# EAGLE design CTR cubesat (EAGLE 9.0.0)
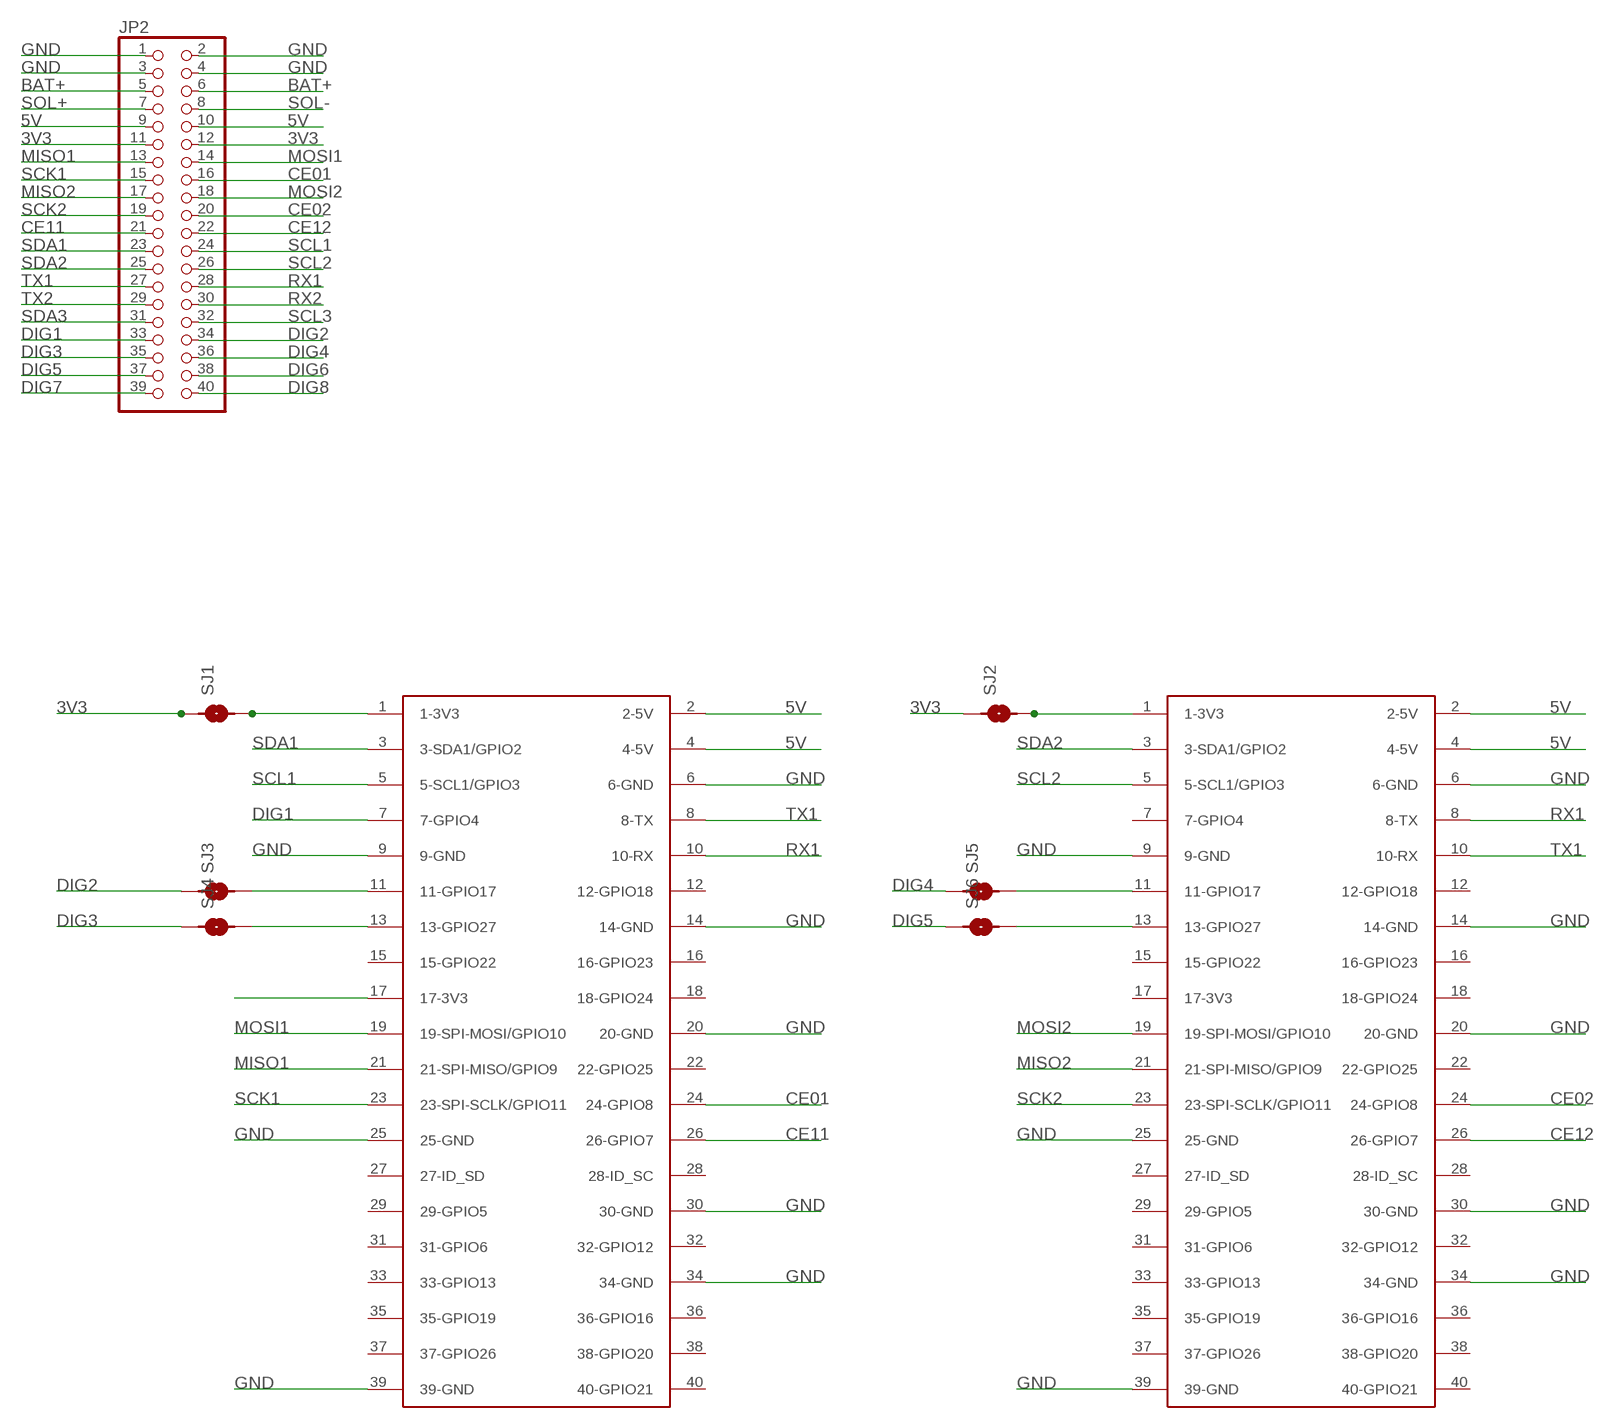
[diagram p0: schematic, sheet 1]

## Parts
JP2  PINHD-2X20  [2X20]
SJ1  SMD-JUMPER-2  [SMD-JUMPER-2]
SJ2  SMD-JUMPER-2  [SMD-JUMPER-2]
SJ3  SMD-JUMPER-2  [SMD-JUMPER-2]
SJ4  SMD-JUMPER-2  [SMD-JUMPER-2]
SJ5  SMD-JUMPER-2  [SMD-JUMPER-2]
SJ6  SMD-JUMPER-2  [SMD-JUMPER-2]
U$1  RASPBERRY-PI+PIZERO  [RASPBERRY-PI-ZERO]
U$2  RASPBERRY-PI+PIZERO  [RASPBERRY-PI-ZERO]

## Nets
3V3: JP2.11 JP2.12 SJ1.1 SJ2.1
5V: JP2.9 JP2.10 U$1.2(2-5V) U$1.4(4-5V) U$2.2(2-5V) U$2.4(4-5V)
BAT+: JP2.5 JP2.6
CE01: JP2.16 U$2.24(24-GPIO8)
CE02: JP2.20 U$1.24(24-GPIO8)
CE11: JP2.21 U$2.26(26-GPIO7)
CE12: JP2.22 U$1.26(26-GPIO7)
DIG1: JP2.33 U$2.7(7-GPIO4)
DIG2: JP2.34 SJ3.1
DIG3: JP2.35 SJ4.1
DIG4: JP2.36 SJ5.1
DIG5: JP2.37 SJ6.1
DIG6: JP2.38
DIG7: JP2.39
DIG8: JP2.40
GND: JP2.1 JP2.2 JP2.3 JP2.4 U$1.6(6-GND) U$1.9(9-GND) U$1.14(14-GND) U$1.20(20-GND) U$1.25(25-GND) U$1.30(30-GND) U$1.34(34-GND) U$1.39(39-GND) U$2.6(6-GND) U$2.9(9-GND) U$2.14(14-GND) U$2.20(20-GND) U$2.25(25-GND) U$2.30(30-GND) U$2.34(34-GND) U$2.39(39-GND)
MISO1: JP2.13 U$2.21(21-SPI-MISO/GPIO9)
MISO2: JP2.17 U$1.21(21-SPI-MISO/GPIO9)
MOSI1: JP2.14 U$2.19(19-SPI-MOSI/GPIO10)
MOSI2: JP2.18 U$1.19(19-SPI-MOSI/GPIO10)
N$1: SJ1.2 U$2.1(1-3V3)
N$2: SJ2.2 U$1.1(1-3V3)
N$3: SJ3.2 U$2.11(11-GPIO17)
N$4: SJ4.2 U$2.13(13-GPIO27)
N$5: U$2.17(17-3V3)
N$6: SJ5.2 U$1.11(11-GPIO17)
N$7: SJ6.2 U$1.13(13-GPIO27)
RX1: JP2.28 U$1.8(8-TX) U$2.10(10-RX)
RX2: JP2.30
SCK1: JP2.15 U$2.23(23-SPI-SCLK/GPIO11)
SCK2: JP2.19 U$1.23(23-SPI-SCLK/GPIO11)
SCL1: JP2.24 U$2.5(5-SCL1/GPIO3)
SCL2: JP2.26 U$1.5(5-SCL1/GPIO3)
SCL3: JP2.32
SDA1: JP2.23 U$2.3(3-SDA1/GPIO2)
SDA2: JP2.25 U$1.3(3-SDA1/GPIO2)
SDA3: JP2.31
SOL+: JP2.7
SOL-: JP2.8
TX1: JP2.27 U$1.10(10-RX) U$2.8(8-TX)
TX2: JP2.29
Unconnected: U$1.7(7-GPIO4) U$1.12(12-GPIO18) U$1.15(15-GPIO22) U$1.16(16-GPIO23) U$1.17(17-3V3) U$1.18(18-GPIO24) U$1.22(22-GPIO25) U$1.27(27-ID_SD) U$1.28(28-ID_SC) U$1.29(29-GPIO5) U$1.31(31-GPIO6) U$1.32(32-GPIO12) U$1.33(33-GPIO13) U$1.35(35-GPIO19) U$1.36(36-GPIO16) U$1.37(37-GPIO26) U$1.38(38-GPIO20) U$1.40(40-GPIO21) U$2.12(12-GPIO18) U$2.15(15-GPIO22) U$2.16(16-GPIO23) U$2.18(18-GPIO24) U$2.22(22-GPIO25) U$2.27(27-ID_SD) U$2.28(28-ID_SC) U$2.29(29-GPIO5) U$2.31(31-GPIO6) U$2.32(32-GPIO12) U$2.33(33-GPIO13) U$2.35(35-GPIO19) U$2.36(36-GPIO16) U$2.37(37-GPIO26) U$2.38(38-GPIO20) U$2.40(40-GPIO21)

## Library data of the parts
JP2 = pinhead:PINHD-2X20: PIN HEADER
SJ1-SJ6 = FaBo-etc:SMD-JUMPER-2
U$1 U$2 = Ava:RASPBERRY-PI+: Samtec SSW-120-01-T-D

## Board
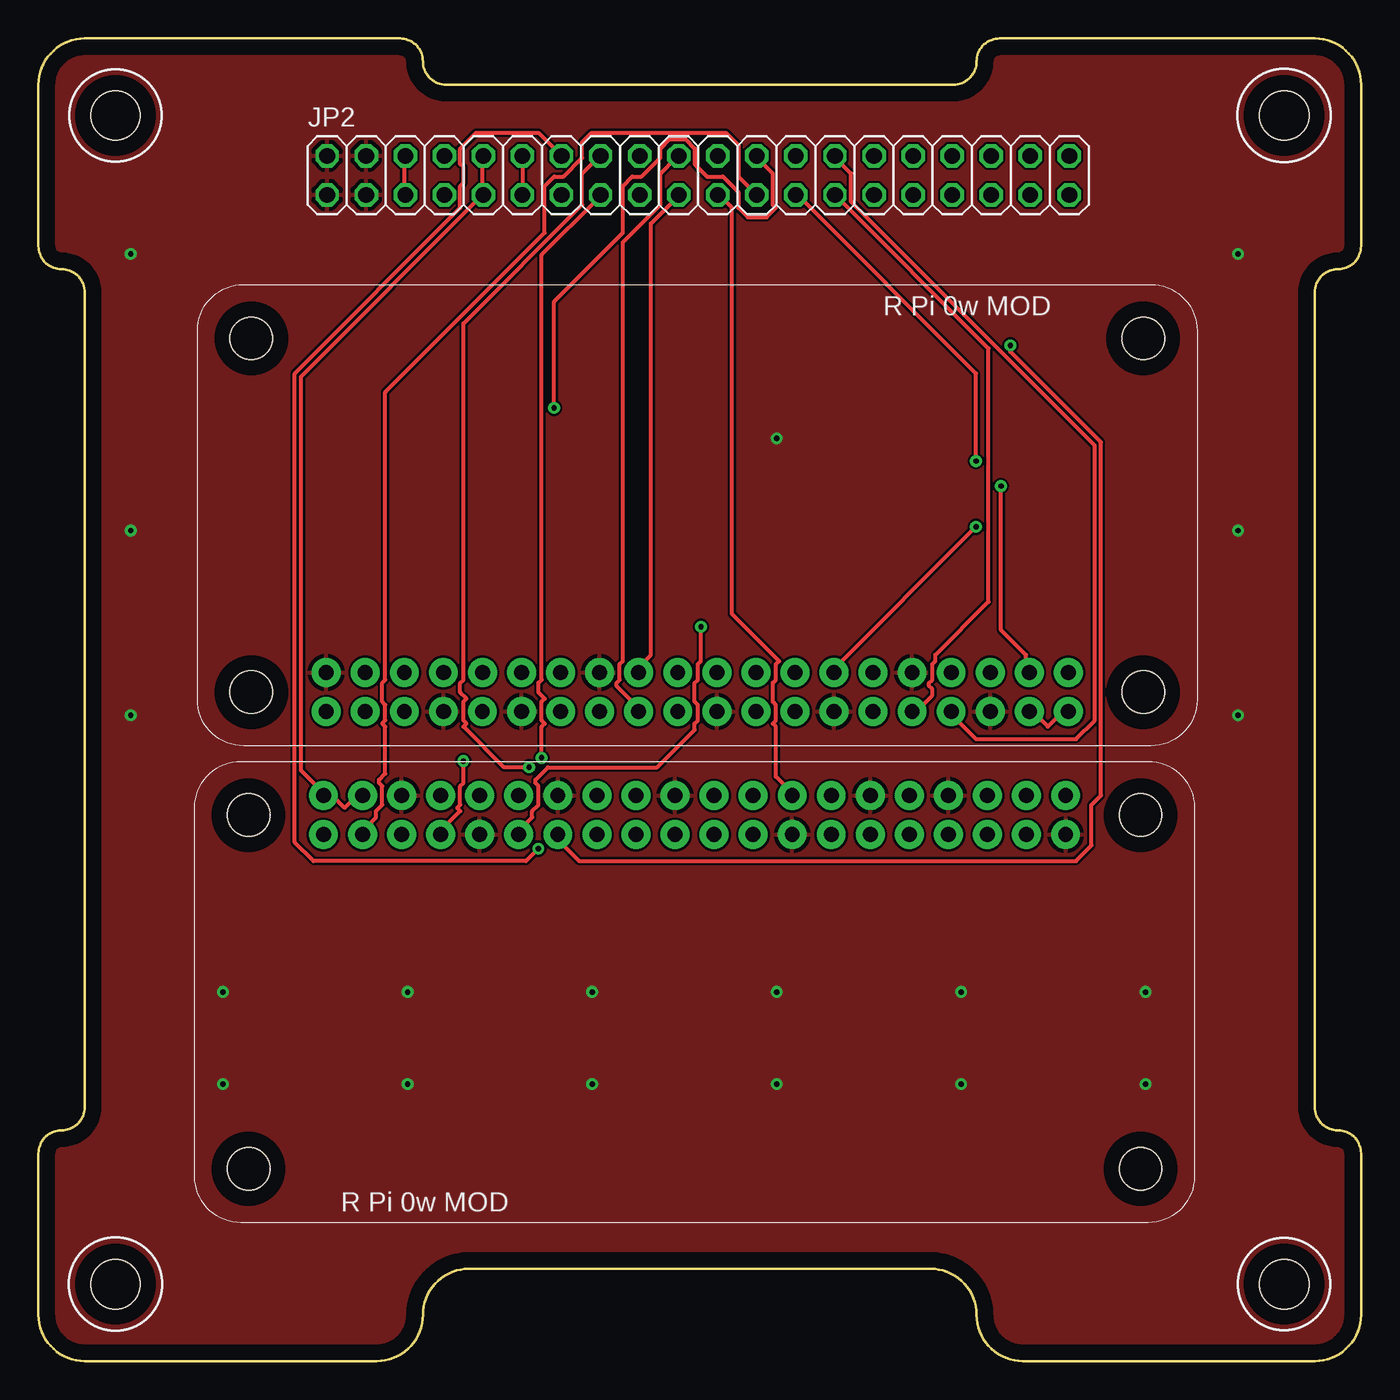
[diagram p1: board, top side]
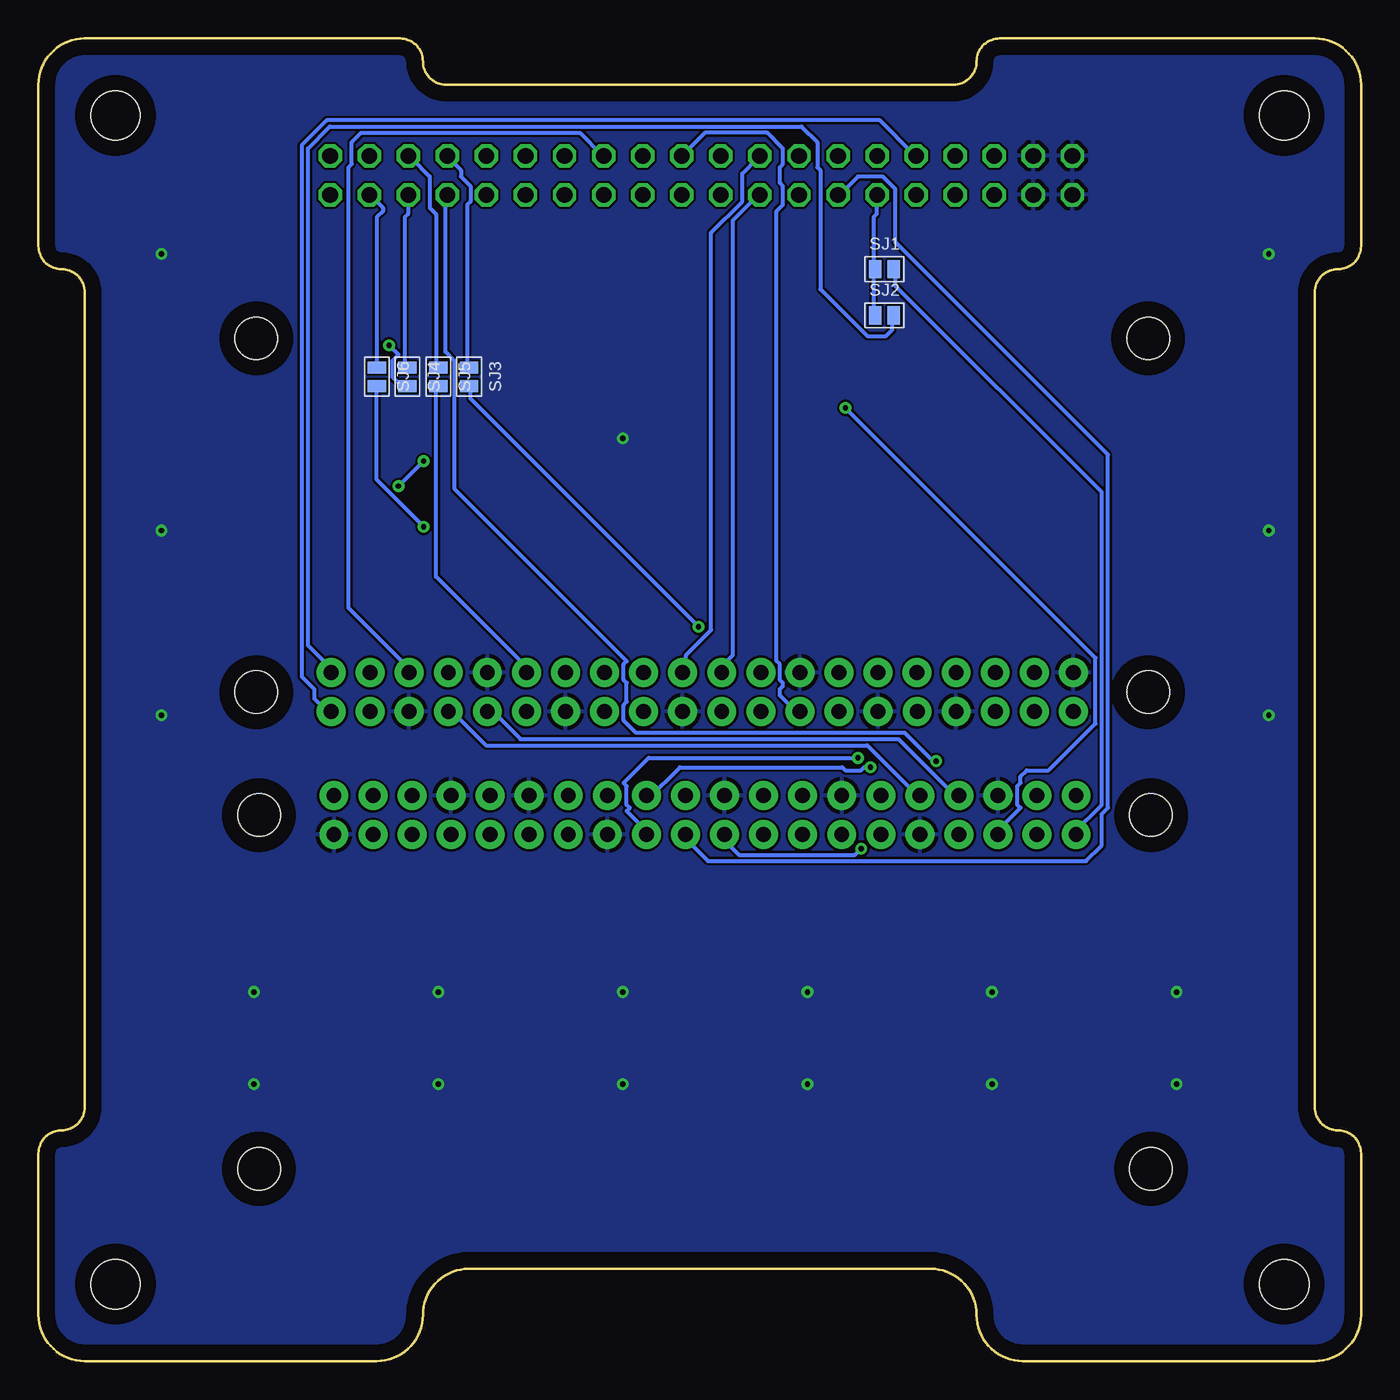
[diagram p2: board, bottom side, seen from below]

Size 86 x 86 mm. Coordinates in mm from the lower left corner, seen from the top.
Outline: 0,83 0,72.5 arc90 1.5,71 arc-90 3,69.5 3,16.5 arc-90 1.5,15 arc90 0,13.5 0,3 arc90 3,0 22,0 arc90 25,3 arc-90 28,6 58,6 arc-90 61,3 arc90 64,0 83,0 arc90 86,3 86,13.5 arc90 84.5,15 arc-90 83,16.5 83,69.5 arc-90 84.5,71 arc90 86,72.5 86,83 arc90 83,86 62.5,86 arc90 61,84.5 arc-90 59.5,83 26.5,83 arc-90 25,84.5 arc90 23.5,86 3,86 arc90 0,83
Copper layers (1*16): Top 0.035mm / dielectric 1.5mm / Bottom 0.035mm
Design rules "default *": minimum track width 10mil, minimum drill 0.35mm, track to track 6mil, track to pad 6mil, pad to pad 6mil, via to via 6mil, smd to smd 6mil, copper to edge 40mil, drill to drill 6mil, minimum pad ring 10mil, minimum via ring 8mil, stop-mask expansion 4mil, vias tented up to drill 100mil, thermal gap 10mil
Holes 3.2 mm at 5,5 81,5 81,81 5,81

### Footprints (pad centres in the part's own frame; a part is rotated, then mirrored left to right if it is on the bottom)
2X20 = drill 1.016 octagon: 1 -24.13,-1.27; 2 -24.13,1.27; 3 -21.59,-1.27; 4 -21.59,1.27; 5 -19.05,-1.27; 6 -19.05,1.27; 7 -16.51,-1.27; 8 -16.51,1.27; 9 -13.97,-1.27; 10 -13.97,1.27; 11 -11.43,-1.27; 12 -11.43,1.27; 13 -8.89,-1.27; 14 -8.89,1.27; 15 -6.35,-1.27; 16 -6.35,1.27; 17 -3.81,-1.27; 18 -3.81,1.27; 19 -1.27,-1.27; 20 -1.27,1.27; 21 1.27,-1.27; 22 1.27,1.27; 23 3.81,-1.27; 24 3.81,1.27; 25 6.35,-1.27; 26 6.35,1.27; 27 8.89,-1.27; 28 8.89,1.27; 29 11.43,-1.27; 30 11.43,1.27; 31 13.97,-1.27; 32 13.97,1.27; 33 16.51,-1.27; 34 16.51,1.27; 35 19.05,-1.27; 36 19.05,1.27; 37 21.59,-1.27; 38 21.59,1.27; 39 24.13,-1.27; 40 24.13,1.27
SMD-JUMPER-2 = smd 0.8 x 1.2: 1 -0.6,0; 2 0.6,0
RASPBERRY-PI-ZERO = drill 0.97 pad 1.88: 1 -23.97,23.23; 2 -23.97,25.77; 3 -21.43,23.23; 4 -21.43,25.77; 5 -18.89,23.23; 6 -18.89,25.77; 7 -16.35,23.23; 8 -16.35,25.77; 9 -13.81,23.23; 10 -13.81,25.77; 11 -11.27,23.23; 12 -11.27,25.77; 13 -8.73,23.23; 14 -8.73,25.77; 15 -6.19,23.23; 16 -6.19,25.77; 17 -3.65,23.23; 18 -3.65,25.77; 19 -1.11,23.23; 20 -1.11,25.77; 21 1.43,23.23; 22 1.43,25.77; 23 3.97,23.23; 24 3.97,25.77; 25 6.51,23.23; 26 6.51,25.77; 27 9.05,23.23; 28 9.05,25.77; 29 11.59,23.23; 30 11.59,25.77; 31 14.13,23.23; 32 14.14,25.77; 33 16.67,23.23; 34 16.67,25.77; 35 19.21,23.23; 36 19.21,25.77; 37 21.75,23.23; 38 21.75,25.77; 39 24.29,23.23; 40 24.29,25.77 | hole 2.75: -28.84,24.5; 29.16,24.5; -28.84,1.5; 29.16,1.5

### Placement (x,y rotation side)
JP2  42.9,77.1 0 top
SJ1  31,71 0 bottom
SJ2  31,68 0 bottom
SJ3  58,64 270 bottom
SJ4  62,64 270 bottom
SJ5  60,64 270 bottom
SJ6  64,64 270 bottom
U$1  43,68 180 top
U$2  42.5,11 0 top

### Tracks (layer width: path | path; a pad name or v marks a point on that pad's centre or on a via)
3V3
  Top 0.254: JP2.12 31.5,78.23 31.5,76 JP2.11
  Bottom 0.254: SJ2.1 31.7,68.07 31.7,70.92 SJ1.1 31.7,71.12 31.7,74.37 31.5,74.57 31.5,75.79 JP2.11
5V
  Top 0.254: U$1.4 64.62,42.06 64.82,42.06 65.63,41.25 66.45,42.06 66.85,42.06 U$1.2 | JP2.10 28.85,78.23 28.85,76 JP2.9 28.85,75.79 17.07,64.01 17.07,38.41 18.69,36.78 U$2.2 18.69,36.58 19.3,36.58 19.91,35.97 20.52,36.58 20.93,36.58 U$2.4
  Bottom 0.254: U$1.2 67.06,42.27 67.46,42.67 67.67,42.67 68.07,43.08 68.07,43.69 68.89,44.5 68.89,79.05 67.26,80.67 31.29,80.67 29.06,78.44 JP2.10
BAT+
  Top 0.254: JP2.5 23.77,76 23.77,78.23 JP2.6
CE01  (via drill 0.35)
  Top 0.254: v31.9,38.61 30.28,38.61 27.64,41.25 27.84,41.45 27.64,41.66 27.64,42.88 27.84,43.08 27.43,43.48 27.43,44.09 27.64,44.3 27.64,67.46 35.36,75.18 35.36,77.22 36.37,78.23 JP2.16
  Bottom 0.254: v31.9,38.61 32.31,38.61 32.51,38.41 33.53,38.41 33.73,38.61 44.3,38.61 46.33,36.58 U$2.24
CE02
  Top 0.254: JP2.20 41.45,78.23 40.44,77.22 40.44,75.18 38,72.75 38,45.52 37.8,45.31 37.8,44.3 37.59,44.09 37.59,43.89 39.22,42.27 U$1.24
CE11
  Top 0.254: JP2.21 44.3,75.79 45.11,74.98 45.11,48.56 48.16,45.52 47.95,45.31 47.95,44.3 47.75,44.09 47.75,42.88 47.95,42.67 47.95,41.66 47.75,41.45 47.95,41.25 47.95,38 49.17,36.78 U$2.26
CE12
  Bottom 0.254: JP2.22 44.09,78.44 42.67,79.86 38.61,79.86 37.59,78.84 37.59,77.83 37.8,77.62 37.8,76.61 37.59,76.4 37.59,75.18 38,74.78 38,45.52 37.8,45.31 37.8,44.3 37.59,44.09 37.59,43.89 37.8,43.69 37.8,43.28 36.58,42.06 U$1.26
DIG1  (via drill 0.35)
  Top 0.254: v27.64,39.01 27.64,37.59 27.43,37.39 27.43,36.17 27.23,35.97 27.43,35.76 26.01,34.34 U$2.7
  Bottom 0.254: v27.64,39.01 27.84,39.01 29.67,40.84 47.14,40.84 47.95,41.66 47.95,42.67 47.75,42.88 47.75,44.09 47.95,44.3 47.95,45.31 47.75,45.52 58.93,56.69 58.93,65.02 59.54,65.63 59.54,75.79 JP2.33
DIG2
  Bottom 0.254: SJ3.1 58.12,64.62 58.12,75.18 57.91,75.39 57.91,76.4 58.52,77.01 58.52,77.42 59.33,78.23 JP2.34
DIG3
  Bottom 0.254: SJ4.1 62.18,64.62 62.18,74.37 61.98,74.57 61.98,75.79 JP2.35
DIG4
  Bottom 0.254: SJ5.1 60.15,64.62 60.15,74.57 60.55,74.98 60.55,77.01 61.77,78.23 JP2.36
DIG5
  Bottom 0.254: SJ6.1 64.01,64.62 64.01,74.37 63.6,74.78 63.6,74.98 64.41,75.79 JP2.37
GND  (via drill 0.35)
  other vias: 12,24 24,24 24,18 36,24 36,18 48,24 48,18 60,24 60,18 72,24 72,18 12,18 6,72 78,72 6,54 78,54 6,42 78,42 48,60
  pour Top: 64,0 83,0 arc90 86,3 86,13.5 arc90 84.5,15 arc-90 83,16.5 83,69.5 arc-90 84.5,71 arc90 86,72.5 86,83 arc90 83,86 62.5,86 arc90 61,84.5 arc-90 59.5,83 26.5,83 arc-90 25,84.5 arc90 23.5,86 3,86 arc90 0,83 0,72.5 arc90 1.5,71 arc-90 3,69.5 3,16.5 arc-90 1.5,15 arc90 0,13.5 0,3 arc90 3,0 22,0 arc90 25,3 arc-90 28,6 58,6 arc-90 61,3 arc90
  pour Bottom: 64,0 83,0 arc90 86,3 86,13.5 arc90 84.5,15 arc-90 83,16.5 83,69.5 arc-90 84.5,71 arc90 86,72.5 86,83 arc90 83,86 62.5,86 arc90 61,84.5 arc-90 59.5,83 26.5,83 arc-90 25,84.5 arc90 23.5,86 3,86 arc90 0,83 0,72.5 arc90 1.5,71 arc-90 3,69.5 3,16.5 arc-90 1.5,15 arc90 0,13.5 0,3 arc90 3,0 22,0 arc90 25,3 arc-90 28,6 58,6 arc-90 61,3 arc90
MISO1
  Bottom 0.254: JP2.13 33.93,76 33.73,76 32.72,77.01 31.09,77.01 30.28,76.2 30.28,72.75 16.46,58.93 16.46,35.97 16.87,35.56 16.87,33.53 17.88,32.51 42.47,32.51 44.09,34.14 U$2.21
MISO2
  Bottom 0.254: JP2.17 39.22,75.79 40.84,74.17 40.84,45.92 41.45,45.31 41.45,44.91 U$1.21
MOSI1  (via drill 0.35)
  Top 0.254: v32.51,33.33 31.7,32.51 17.88,32.51 16.66,33.73 16.66,64.21 27.43,74.98 27.43,76.4 27.64,76.61 27.64,77.62 27.43,77.83 27.43,78.84 28.45,79.86 32.51,79.86 33.93,78.44 JP2.14
  Bottom 0.254: v32.51,33.33 32.92,32.92 40.44,32.92 41.25,33.73 41.25,34.14 U$2.19
MOSI2
  Bottom 0.254: JP2.18 39.22,78.23 40.23,77.22 40.23,75.39 42.27,73.36 42.27,47.55 43.89,45.92 43.89,45.11 44.09,44.91 U$1.19
N$1
  Bottom 0.254: SJ1.2 30.28,70.92 30.28,69.9 16.87,56.49 16.87,36.17 18.69,34.34 U$2.1
N$2
  Bottom 0.254: SJ2.2 30.48,67.87 30.48,67.06 30.89,66.65 32.11,66.65 35.15,69.7 35.15,77.42 35.36,77.62 35.36,79.25 36.37,80.26 67.06,80.26 68.48,78.84 68.48,46.53 66.85,44.91 U$1.1
N$3  (via drill 0.35)
  Top 0.254: v43.08,47.75 43.08,45.52 42.88,45.31 42.88,44.3 42.67,44.09 42.67,42.88 42.88,42.67 42.88,41.66 42.67,41.45 42.67,41.05 40.23,38.61 33.12,38.61 32.31,37.8 32.31,37.59 32.51,37.39 32.51,36.17 32.11,35.76 32.11,35.36 31.09,34.34 U$2.11
  Bottom 0.254: v43.08,47.75 57.91,62.59 57.91,63.4 SJ3.2
N$4  (via drill 0.35)
  Top 0.254: v63.2,66.04 63.2,65.63 69.09,59.74 69.09,36.78 68.48,36.17 68.48,33.53 67.46,32.51 35.15,32.51 33.93,33.73 33.93,34.14 U$2.13
  Bottom 0.254: v63.2,66.04 62.59,65.43 62.99,65.02 62.99,64.01 62.59,63.6 62.18,63.6 SJ4.2
N$6
  Bottom 0.254: SJ5.2 60.15,63.4 60.15,51 54.46,45.31 54.46,44.91 U$1.11
N$7  (via drill 0.35)
  Top 0.254: v60.96,54.25 51.61,44.91 U$1.13
  Bottom 0.254: v60.96,54.25 64.01,57.3 SJ6.2
RX1
  Top 0.254: JP2.28 51.82,78.23 52.83,77.22 52.83,75.39 68.68,59.54 68.68,41.66 67.46,40.44 60.96,40.44 59.33,42.06 U$1.8
  Bottom 0.254: U$2.10 28.85,36.78 32.11,40.03 56.9,40.03 58.93,42.06 59.33,42.06 U$1.8
SCK1  (via drill 0.35)
  Top 0.254: v32.72,39.22 32.72,41.25 32.92,41.45 32.72,41.66 32.72,42.88 32.92,43.08 32.51,43.48 32.51,44.09 32.72,44.3 32.72,71.93 36.37,75.59 36.37,75.79 JP2.15
  Bottom 0.254: v32.72,39.22 46.33,39.22 47.95,37.59 47.75,37.39 47.75,36.17 47.55,35.97 47.75,35.76 46.33,34.34 U$2.23
SCK2
  Top 0.254: JP2.19 41.45,75.79 41.45,75.59 39.83,73.97 39.83,45.92 39.22,45.31 39.22,44.91 U$1.23
SCL1  (via drill 0.35)
  Top 0.254: v33.53,61.98 33.53,68.89 38,73.36 38,76.4 38.61,77.01 39.22,77.01 40.44,78.23 40.44,78.84 41.05,79.45 42.06,79.45 42.67,78.84 42.67,77.83 43.48,77.01 44.5,77.01 45.52,76 45.52,74.98 46.13,74.37 47.35,74.37 47.95,74.98 47.75,75.18 47.75,77.22 46.74,78.23 JP2.24
  Bottom 0.254: v33.53,61.98 17.27,45.72 17.27,41.45 20.32,38.41 21.74,38.41 22.15,38 22.15,37.59 22.35,37.39 22.35,36.17 22.15,35.97 23.77,34.34 U$2.5
SCL2
  Bottom 0.254: JP2.26 49.38,78.44 50.8,79.86 65.02,79.86 65.63,79.25 65.63,77.83 65.84,77.62 65.84,48.97 61.77,44.91 U$1.5
SDA1
  Top 0.254: JP2.23 46.53,76 45.52,77.01 45.52,79.05 44.7,79.86 35.97,79.86 35.36,79.25 35.36,78.23 34.14,77.01 33.53,77.01 32.92,76.4 32.92,73.36 22.55,62.99 22.55,44.3 22.35,44.09 22.35,42.88 22.55,42.67 22.55,41.66 22.35,41.45 22.55,41.25 22.55,38.2 22.15,37.8 22.15,37.59 22.35,37.39 22.35,36.17 21.95,35.76 21.95,35.36 20.93,34.34 U$2.3
SDA2  (via drill 0.35)
  Top 0.254: v60.96,58.52 60.96,64.21 49.38,75.79 JP2.25 | v62.59,56.9 62.59,47.55 64.21,45.92 64.21,45.11 64.41,44.91 U$1.3
  Bottom 0.254: v62.59,56.9 v60.96,58.52
TX1
  Top 0.254: JP2.27 51.82,75.79 61.77,65.84 61.77,49.38 58.32,45.92 58.32,45.52 58.12,45.31 58.12,44.3 57.91,44.09 57.91,43.89 58.12,43.69 58.12,43.28 56.9,42.06 U$1.10
  Bottom 0.254: U$2.8 26.21,36.78 26.62,37.19 26.82,37.19 30.07,40.44 54.66,40.44 56.29,42.06 56.69,42.06 U$1.10